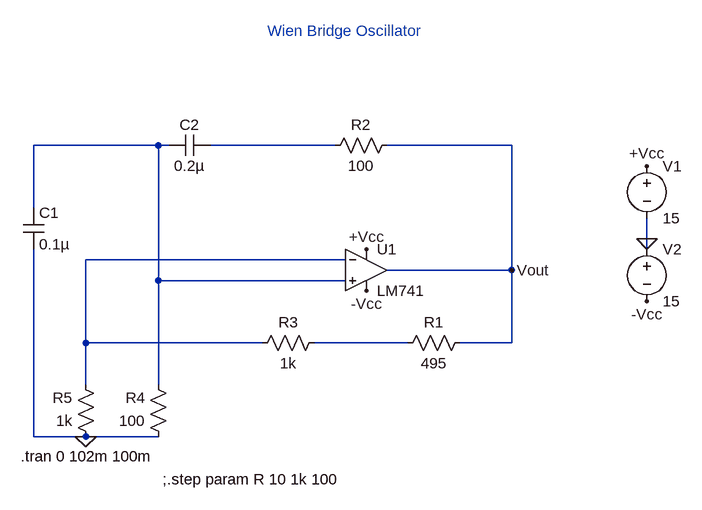
[diagram p0: schematic wienbridge.asc]
wienbridge.asc, the LTspice schematic file:
Version 4
SHEET 1 880 680
WIRE -16 -48 -208 -48
WIRE 0 -48 -16 -48
WIRE 256 -48 64 -48
WIRE 528 -48 336 -48
WIRE -208 48 -208 -48
WIRE 736 96 736 64
WIRE 736 112 736 96
WIRE 272 128 -128 128
WIRE 528 144 528 -48
WIRE 528 144 336 144
WIRE -16 160 -16 -48
WIRE 272 160 -16 160
WIRE -128 256 -128 128
WIRE 144 256 -128 256
WIRE 368 256 224 256
WIRE 528 256 528 144
WIRE 528 256 448 256
WIRE -128 320 -128 256
WIRE -16 320 -16 160
WIRE -208 400 -208 112
WIRE -128 400 -208 400
WIRE -16 400 -128 400
FLAG 736 96 0
FLAG 736 -16 +Vcc
FLAG 304 112 +Vcc
FLAG 304 176 -Vcc
FLAG 736 192 -Vcc
FLAG 528 144 Vout
FLAG -128 400 0
SYMBOL Opamps\\LM741 304 80 R0
SYMATTR InstName U1
SYMATTR SpiceModel ""
SYMBOL res 464 240 R90
WINDOW 0 0 56 VBottom 2
WINDOW 3 32 56 VTop 2
SYMATTR InstName R1
SYMATTR Value 495
SYMBOL res 352 -64 R90
WINDOW 0 0 56 VBottom 2
WINDOW 3 32 56 VTop 2
SYMATTR InstName R2
SYMATTR Value 100
SYMBOL res 240 240 R90
WINDOW 0 0 56 VBottom 2
WINDOW 3 32 56 VTop 2
SYMATTR InstName R3
SYMATTR Value 1k
SYMBOL res 0 416 R180
WINDOW 0 36 76 Left 2
WINDOW 3 36 40 Left 2
SYMATTR InstName R4
SYMATTR Value 100
SYMBOL res -112 416 R180
WINDOW 0 36 76 Left 2
WINDOW 3 36 40 Left 2
SYMATTR InstName R5
SYMATTR Value 1k
SYMBOL cap -224 48 R0
SYMATTR InstName C1
SYMATTR Value 0.1µ
SYMBOL cap 64 -64 R90
WINDOW 0 0 32 VBottom 2
WINDOW 3 32 32 VTop 2
SYMATTR InstName C2
SYMATTR Value 0.2µ
SYMBOL voltage 736 -32 R0
SYMATTR InstName V1
SYMATTR Value 15
SYMBOL voltage 736 96 R0
SYMATTR InstName V2
SYMATTR Value 15
TEXT 152 -224 Left 2 ;Wien Bridge Oscillator
TEXT -10 466 Left 2 !;.step param R 10 1k 100
TEXT -228 430 Left 2 !.tran 0 102m 100m

The netlist it stands for:
* wienbridge.asc
XU1 N001 N003 +Vcc -Vcc Vout LM741  ; pins In+ In- V+ V- OUT
R1 Vout N004 495
R2 Vout N002 100
R3 N004 N003 1k
R4 0 N001 100
R5 0 N003 1k
C1 N001 0 0.1µ
C2 N002 N001 0.2µ
V1 +Vcc 0 15
V2 0 -Vcc 15
* Wien Bridge Oscillator
;.step param R 10 1k 100
.tran 0 102m 100m
.lib LM741.lib
.backanno
.end